# EAGLE schematic M1705Beco (EAGLE 6.6.0)

## Sheet 1 of 3
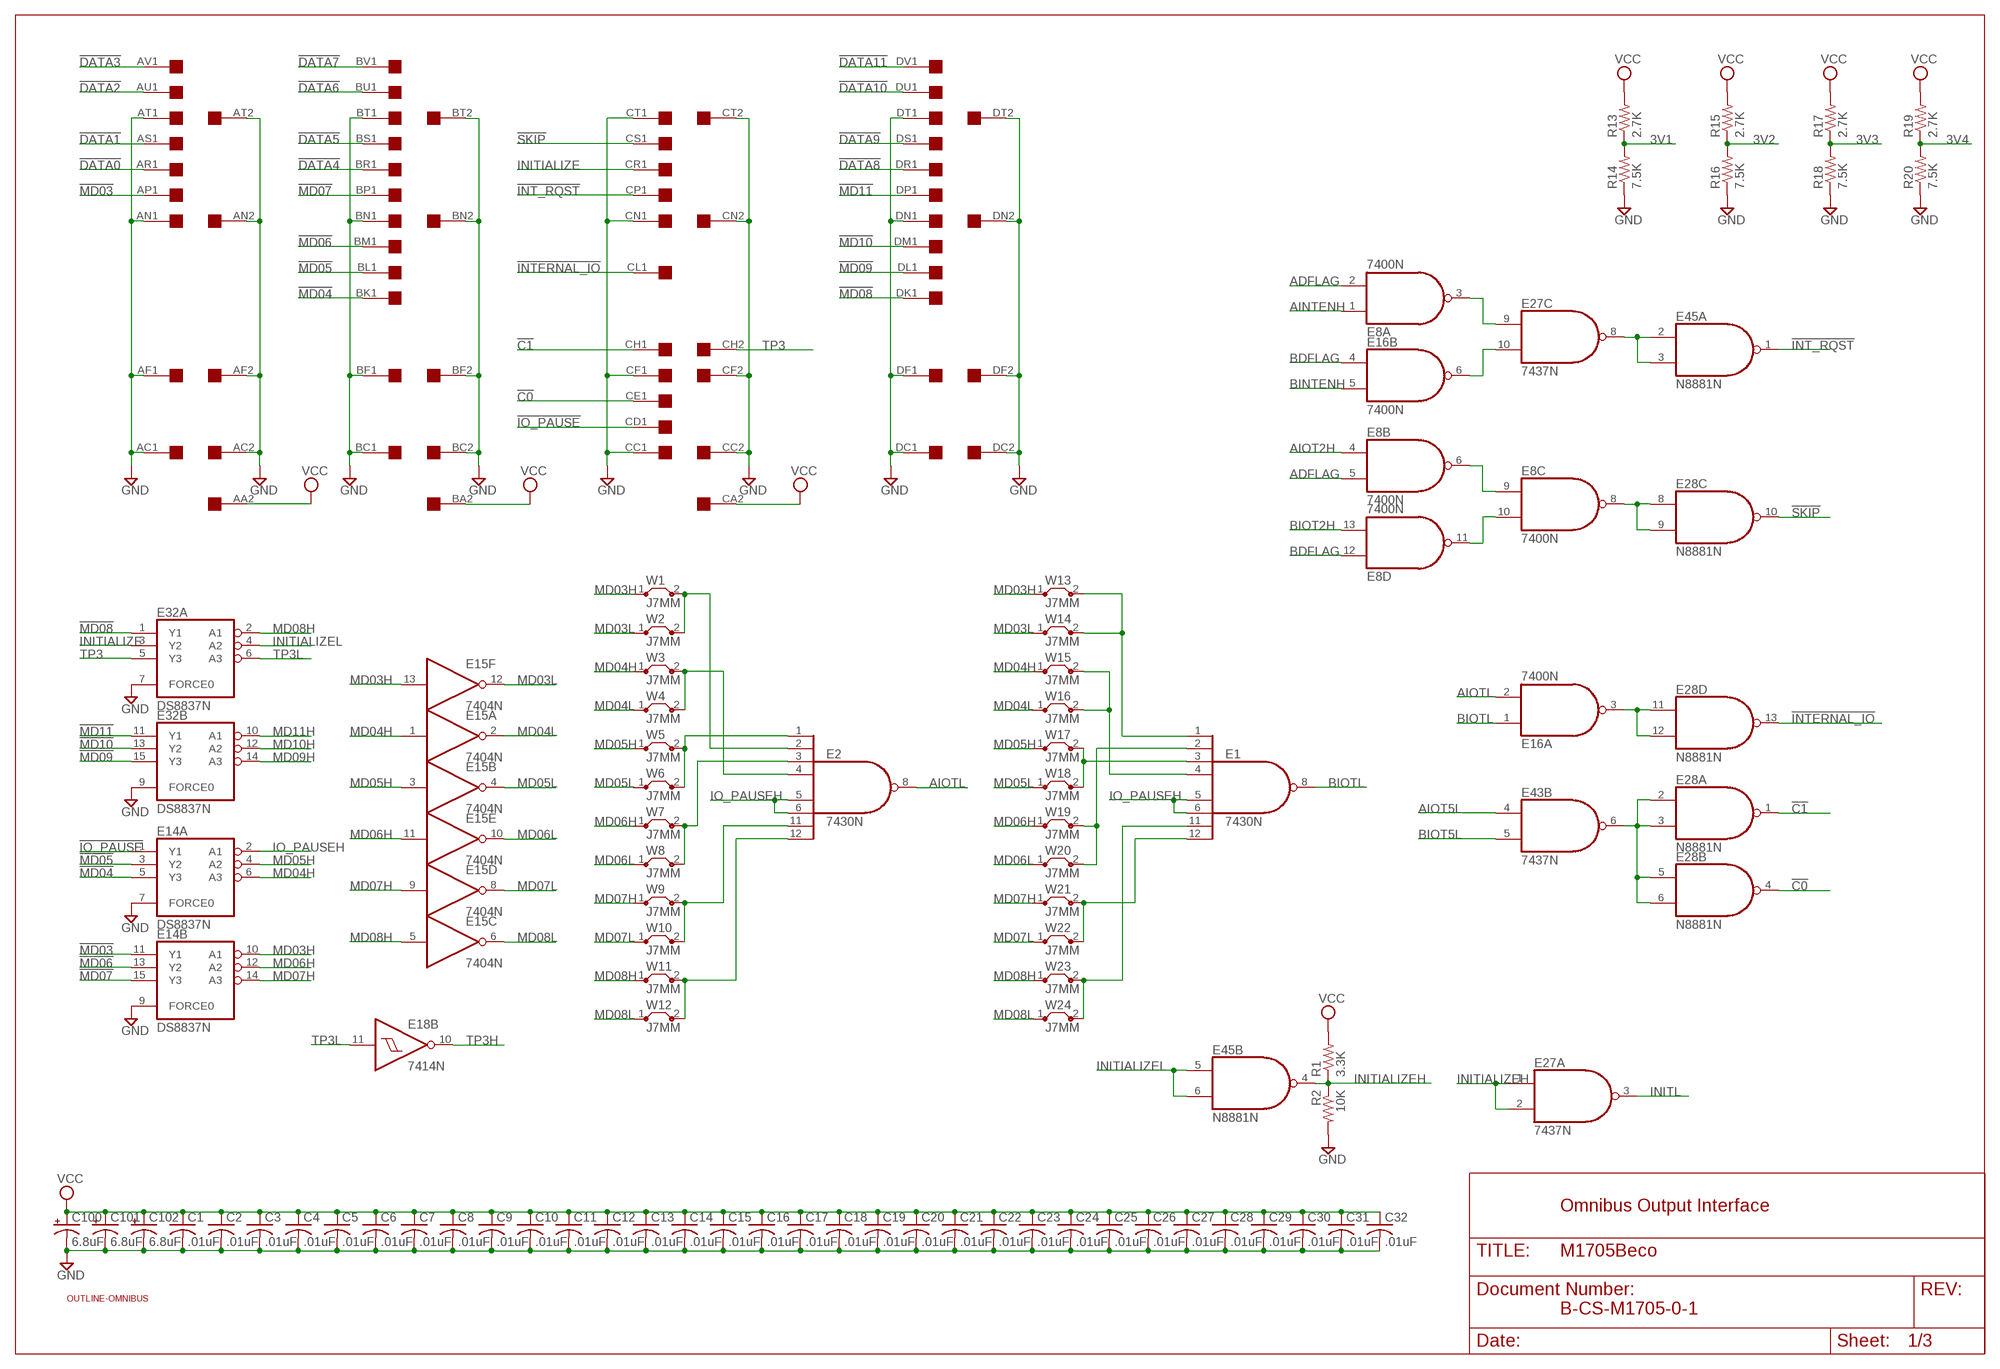
[diagram p0: schematic, sheet 1]

### Parts
C1  .01uF  C-US075-032X103  [C075-032X103]
C2  .01uF  C-US075-032X103  [C075-032X103]
C3  .01uF  C-US075-032X103  [C075-032X103]
C4  .01uF  C-US075-032X103  [C075-032X103]
C5  .01uF  C-US075-032X103  [C075-032X103]
C6  .01uF  C-US075-032X103  [C075-032X103]
C7  .01uF  C-US075-032X103  [C075-032X103]
C8  .01uF  C-US075-032X103  [C075-032X103]
C9  .01uF  C-US075-032X103  [C075-032X103]
C10  .01uF  C-US075-032X103  [C075-032X103]
C11  .01uF  C-US075-032X103  [C075-032X103]
C12  .01uF  C-US075-032X103  [C075-032X103]
C13  .01uF  C-US075-032X103  [C075-032X103]
C14  .01uF  C-US075-032X103  [C075-032X103]
C15  .01uF  C-US075-032X103  [C075-032X103]
C16  .01uF  C-US075-032X103  [C075-032X103]
C17  .01uF  C-US075-032X103  [C075-032X103]
C18  .01uF  C-US075-032X103  [C075-032X103]
C19  .01uF  C-US075-032X103  [C075-032X103]
C20  .01uF  C-US075-032X103  [C075-032X103]
C21  .01uF  C-US075-032X103  [C075-032X103]
C22  .01uF  C-US075-032X103  [C075-032X103]
C23  .01uF  C-US075-032X103  [C075-032X103]
C24  .01uF  C-US075-032X103  [C075-032X103]
C25  .01uF  C-US075-032X103  [C075-032X103]
C26  .01uF  C-US075-032X103  [C075-032X103]
C27  .01uF  C-US075-032X103  [C075-032X103]
C28  .01uF  C-US075-032X103  [C075-032X103]
C29  .01uF  C-US075-032X103  [C075-032X103]
C30  .01uF  C-US075-032X103  [C075-032X103]
C31  .01uF  C-US075-032X103  [C075-032X103]
C32  .01uF  C-US075-032X103  [C075-032X103]
C100  6.8uF  CPOL-USE20-8AXIAL  [E12-8]
C101  6.8uF  CPOL-USE20-8AXIAL  [E12-8]
C102  6.8uF  CPOL-USE20-8AXIAL  [E12-8]
E1  7430N  [DIL14]
E2  7430N  [DIL14]
E8  7400N  [DIL14]
E14  DS8837N  [DIL16]
E15  7404N  [DIL14]
E16  7400N  [DIL14]
E18  7414N  [DIL14]
E27  7437N  [DIL14]
E28  N8881N  [DIL14]
E32  DS8837N  [DIL16]
E43  7437N  [DIL14]
E45  N8881N  [DIL14]
R1  3.3K  R-US_0207/10  [0207/10]
R2  10K  R-US_0207/10  [0207/10]
R13  2.7K  R-US_0207/10  [0207/10]
R14  7.5K  R-US_0207/10  [0207/10]
R15  2.7K  R-US_0207/10  [0207/10]
R16  7.5K  R-US_0207/10  [0207/10]
R17  2.7K  R-US_0207/10  [0207/10]
R18  7.5K  R-US_0207/10  [0207/10]
R19  2.7K  R-US_0207/10  [0207/10]
R20  7.5K  R-US_0207/10  [0207/10]
U$2  QUAD  [EDGE-CON8]
U$4  OUTLINE-OMNIBUS  [OMNIBUS]
W1  J7MM  [07]
W2  J7MM  [07]
W3  J7MM  [07]
W4  J7MM  [07]
W5  J7MM  [07]
W6  J7MM  [07]
W7  J7MM  [07]
W8  J7MM  [07]
W9  J7MM  [07]
W10  J7MM  [07]
W11  J7MM  [07]
W12  J7MM  [07]
W13  J7MM  [07]
W14  J7MM  [07]
W15  J7MM  [07]
W16  J7MM  [07]
W17  J7MM  [07]
W18  J7MM  [07]
W19  J7MM  [07]
W20  J7MM  [07]
W21  J7MM  [07]
W22  J7MM  [07]
W23  J7MM  [07]
W24  J7MM  [07]

### Nets
3V1: R13.1 R14.2 ; also sheet 2,3
3V2: R15.1 R16.2 ; also sheet 2,3
3V3: R17.1 R18.2 ; also sheet 2,3
3V4: R19.1 R20.2 ; also sheet 2,3
!C0: E28.4(B:O) U$2.CE1
!C1: E28.1(A:O) U$2.CH1
!DATA0: U$2.AR1 ; also sheet 2,3
!DATA1: U$2.AS1 ; also sheet 2,3
!DATA2: U$2.AU1 ; also sheet 2,3
!DATA3: U$2.AV1 ; also sheet 2,3
!DATA4: U$2.BR1 ; also sheet 2,3
!DATA5: U$2.BS1 ; also sheet 2,3
!DATA6: U$2.BU1 ; also sheet 2,3
!DATA7: U$2.BV1 ; also sheet 2,3
!DATA8: U$2.DR1 ; also sheet 2,3
!DATA9: U$2.DS1 ; also sheet 2,3
!DATA10: U$2.DU1 ; also sheet 2,3
!DATA11: U$2.DV1 ; also sheet 2,3
!INT_RQST: E45.1(A:O) U$2.CP1
!INTERNAL_IO: E28.13(D:O) U$2.CL1
!IO_PAUSE: E14.1(A:Y1) U$2.CD1
!MD03: E14.11(B:Y1) U$2.AP1
!MD04: E14.5(A:Y3) U$2.BK1
!MD05: E14.3(A:Y2) U$2.BL1
!MD06: E14.13(B:Y2) U$2.BM1
!MD07: E14.15(B:Y3) U$2.BP1
!MD08: E32.1(A:Y1) U$2.DK1
!MD09: E32.15(B:Y3) U$2.DL1
!MD10: E32.13(B:Y2) U$2.DM1
!MD11: E32.11(B:Y1) U$2.DP1
!SKIP: E28.10(C:O) U$2.CS1
ADFLAG: E8.2(A:I1) E8.5(B:I1) ; also sheet 2
AINTENH: E8.1(A:I0) ; also sheet 2
AIOT2H: E8.4(B:I0) ; also sheet 2
AIOT5L: E43.4(B:I0) ; also sheet 2
AIOTL: E2.8(O) E16.2(A:I1) ; also sheet 2
BDFLAG: E8.12(D:I0) E16.4(B:I0) ; also sheet 3
BINTENH: E16.5(B:I1) ; also sheet 3
BIOT2H: E8.13(D:I1) ; also sheet 3
BIOT5L: E43.5(B:I1) ; also sheet 3
BIOTL: E1.8(O) E16.1(A:I0) ; also sheet 3
GND [Supply]: C1.2 C2.2 C3.2 C4.2 C5.2 C6.2 C7.2 C8.2 C9.2 C10.2 C11.2 C12.2 C13.2 C14.2 C15.2 C16.2 C17.2 C18.2 C19.2 C20.2 C21.2 C22.2 C23.2 C24.2 C25.2 C26.2 C27.2 C28.2 C29.2 C30.2 C31.2 C32.2 C100.- C101.- C102.- E14.7(A:FORCE0) E14.9(B:FORCE0) E32.7(A:FORCE0) E32.9(B:FORCE0) R2.2 R14.1 R16.1 R18.1 R20.1 U$2.AC1 U$2.AC2 U$2.AF1 U$2.AF2 U$2.AN1 U$2.AN2 U$2.AT1 U$2.AT2 U$2.BC1 U$2.BC2 U$2.BF1 U$2.BF2 U$2.BN1 U$2.BN2 U$2.BT1 U$2.BT2 U$2.CC1 U$2.CC2 U$2.CF1 U$2.CF2 U$2.CN1 U$2.CN2 U$2.CT1 U$2.CT2 U$2.DC1 U$2.DC2 U$2.DF1 U$2.DF2 U$2.DN1 U$2.DN2 U$2.DT1 U$2.DT2 ; also sheet 2,3
INITIALIZE: E32.3(A:Y2) U$2.CR1
INITIALIZEH: E27.1(A:I0) E27.2(A:I1) E45.4(B:O) R1.1 R2.1
INITIALIZEL: E32.4(A:A2) E45.5(B:I0) E45.6(B:I1) ; also sheet 2,3
INITL: E27.3(A:O) ; also sheet 2,3
IO_PAUSEH: E1.5(I4) E1.6(I5) E2.5(I4) E2.6(I5) E14.2(A:A1)
MD03H: E14.10(B:A1) E15.13(F:I) W1.1 W13.1
MD03L: E15.12(F:O) W2.1 W14.1
MD04H: E14.6(A:A3) E15.1(A:I) W3.1 W15.1
MD04L: E15.2(A:O) W4.1 W16.1
MD05H: E14.4(A:A2) E15.3(B:I) W5.1 W17.1
MD05L: E15.4(B:O) W6.1 W18.1
MD06H: E14.12(B:A2) E15.11(E:I) W7.1 W19.1
MD06L: E15.10(E:O) W8.1 W20.1
MD07H: E14.14(B:A3) E15.9(D:I) W9.1 W21.1
MD07L: E15.8(D:O) W10.1 W22.1
MD08H: E15.5(C:I) E32.2(A:A1) W11.1 W23.1
MD08L: E15.6(C:O) W12.1 W24.1
MD09H: E32.14(B:A3) ; also sheet 2,3
MD10H: E32.12(B:A2) ; also sheet 2,3
MD11H: E32.10(B:A1) ; also sheet 2,3
N$24: E1.3(I2) W17.2 W18.2
N$29: E1.1(I0) W13.2 W14.2
N$31: E2.11(I6) W9.2 W10.2
N$32: E1.12(I7) W21.2 W22.2
N$33: E1.11(I6) W23.2 W24.2
N$36: E1.4(I3) W15.2 W16.2
N$38: E1.2(I1) W19.2 W20.2
N$39: E2.1(I0) W5.2 W6.2
N$40: E2.2(I1) W1.2 W2.2
N$41: E2.3(I2) W7.2 W8.2
N$42: E2.4(I3) W3.2 W4.2
N$45: E2.12(I7) W11.2 W12.2
N$53: E8.8(C:O) E28.8(C:I0) E28.9(C:I1)
N$118: E8.3(A:O) E27.9(C:I0)
N$119: E8.10(C:I1) E8.11(D:O)
N$120: E8.6(B:O) E8.9(C:I0)
N$196: E16.3(A:O) E28.11(D:I0) E28.12(D:I1)
N$199: E16.6(B:O) E27.10(C:I1)
N$337: E28.2(A:I0) E28.3(A:I1) E28.5(B:I0) E28.6(B:I1) E43.6(B:O)
N$350: E27.8(C:O) E45.2(A:I0) E45.3(A:I1)
TP3: E32.5(A:Y3) U$2.CH2
TP3H: E18.10(B:O) ; also sheet 2,3
TP3L: E18.11(B:I) E32.6(A:A3)
VCC [Supply]: C1.1 C2.1 C3.1 C4.1 C5.1 C6.1 C7.1 C8.1 C9.1 C10.1 C11.1 C12.1 C13.1 C14.1 C15.1 C16.1 C17.1 C18.1 C19.1 C20.1 C21.1 C22.1 C23.1 C24.1 C25.1 C26.1 C27.1 C28.1 C29.1 C30.1 C31.1 C32.1 C100.+ C101.+ C102.+ R1.2 R13.2 R15.2 R17.2 R19.2 U$2.AA2 U$2.BA2 U$2.CA2 ; also sheet 2,3
Unconnected: E18.12(A:O) E18.13(A:I) E45.8(C:I0) E45.9(C:I1) E45.10(C:O) E45.11(D:I0) E45.12(D:I1) E45.13(D:O) U$2.AA1 U$2.AB1 U$2.AB2 U$2.AD1 U$2.AD2 U$2.AE1 U$2.AE2 U$2.AH1 U$2.AH2 U$2.AJ1 U$2.AJ2 U$2.AK1 U$2.AK2 U$2.AL1 U$2.AL2 U$2.AM1 U$2.AM2 U$2.AP2 U$2.AR2 U$2.AS2 U$2.AU2 U$2.AV2 U$2.BA1 U$2.BB1 U$2.BB2 U$2.BD1 U$2.BD2 U$2.BE1 U$2.BE2 U$2.BH1 U$2.BH2 U$2.BJ1 U$2.BJ2 U$2.BK2 U$2.BL2 U$2.BM2 U$2.BP2 U$2.BR2 U$2.BS2 U$2.BU2 U$2.BV2 U$2.CA1 U$2.CB1 U$2.CB2 U$2.CD2 U$2.CE2 U$2.CJ1 U$2.CJ2 U$2.CK1 U$2.CK2 U$2.CL2 U$2.CM1 U$2.CM2 U$2.CP2 U$2.CR2 U$2.CS2 U$2.CU1 U$2.CU2 U$2.CV1 U$2.CV2 U$2.DA1 U$2.DA2 U$2.DB1 U$2.DB2 U$2.DD1 U$2.DD2 U$2.DE1 U$2.DE2 U$2.DH1 U$2.DH2 U$2.DJ1 U$2.DJ2 U$2.DK2 U$2.DL2 U$2.DM2 U$2.DP2 U$2.DR2 U$2.DS2 U$2.DU2 U$2.DV2

### Notes on the sheet
- Omnibus Output Interface
- B-CS-M1705-0-1

## Sheet 2 of 3
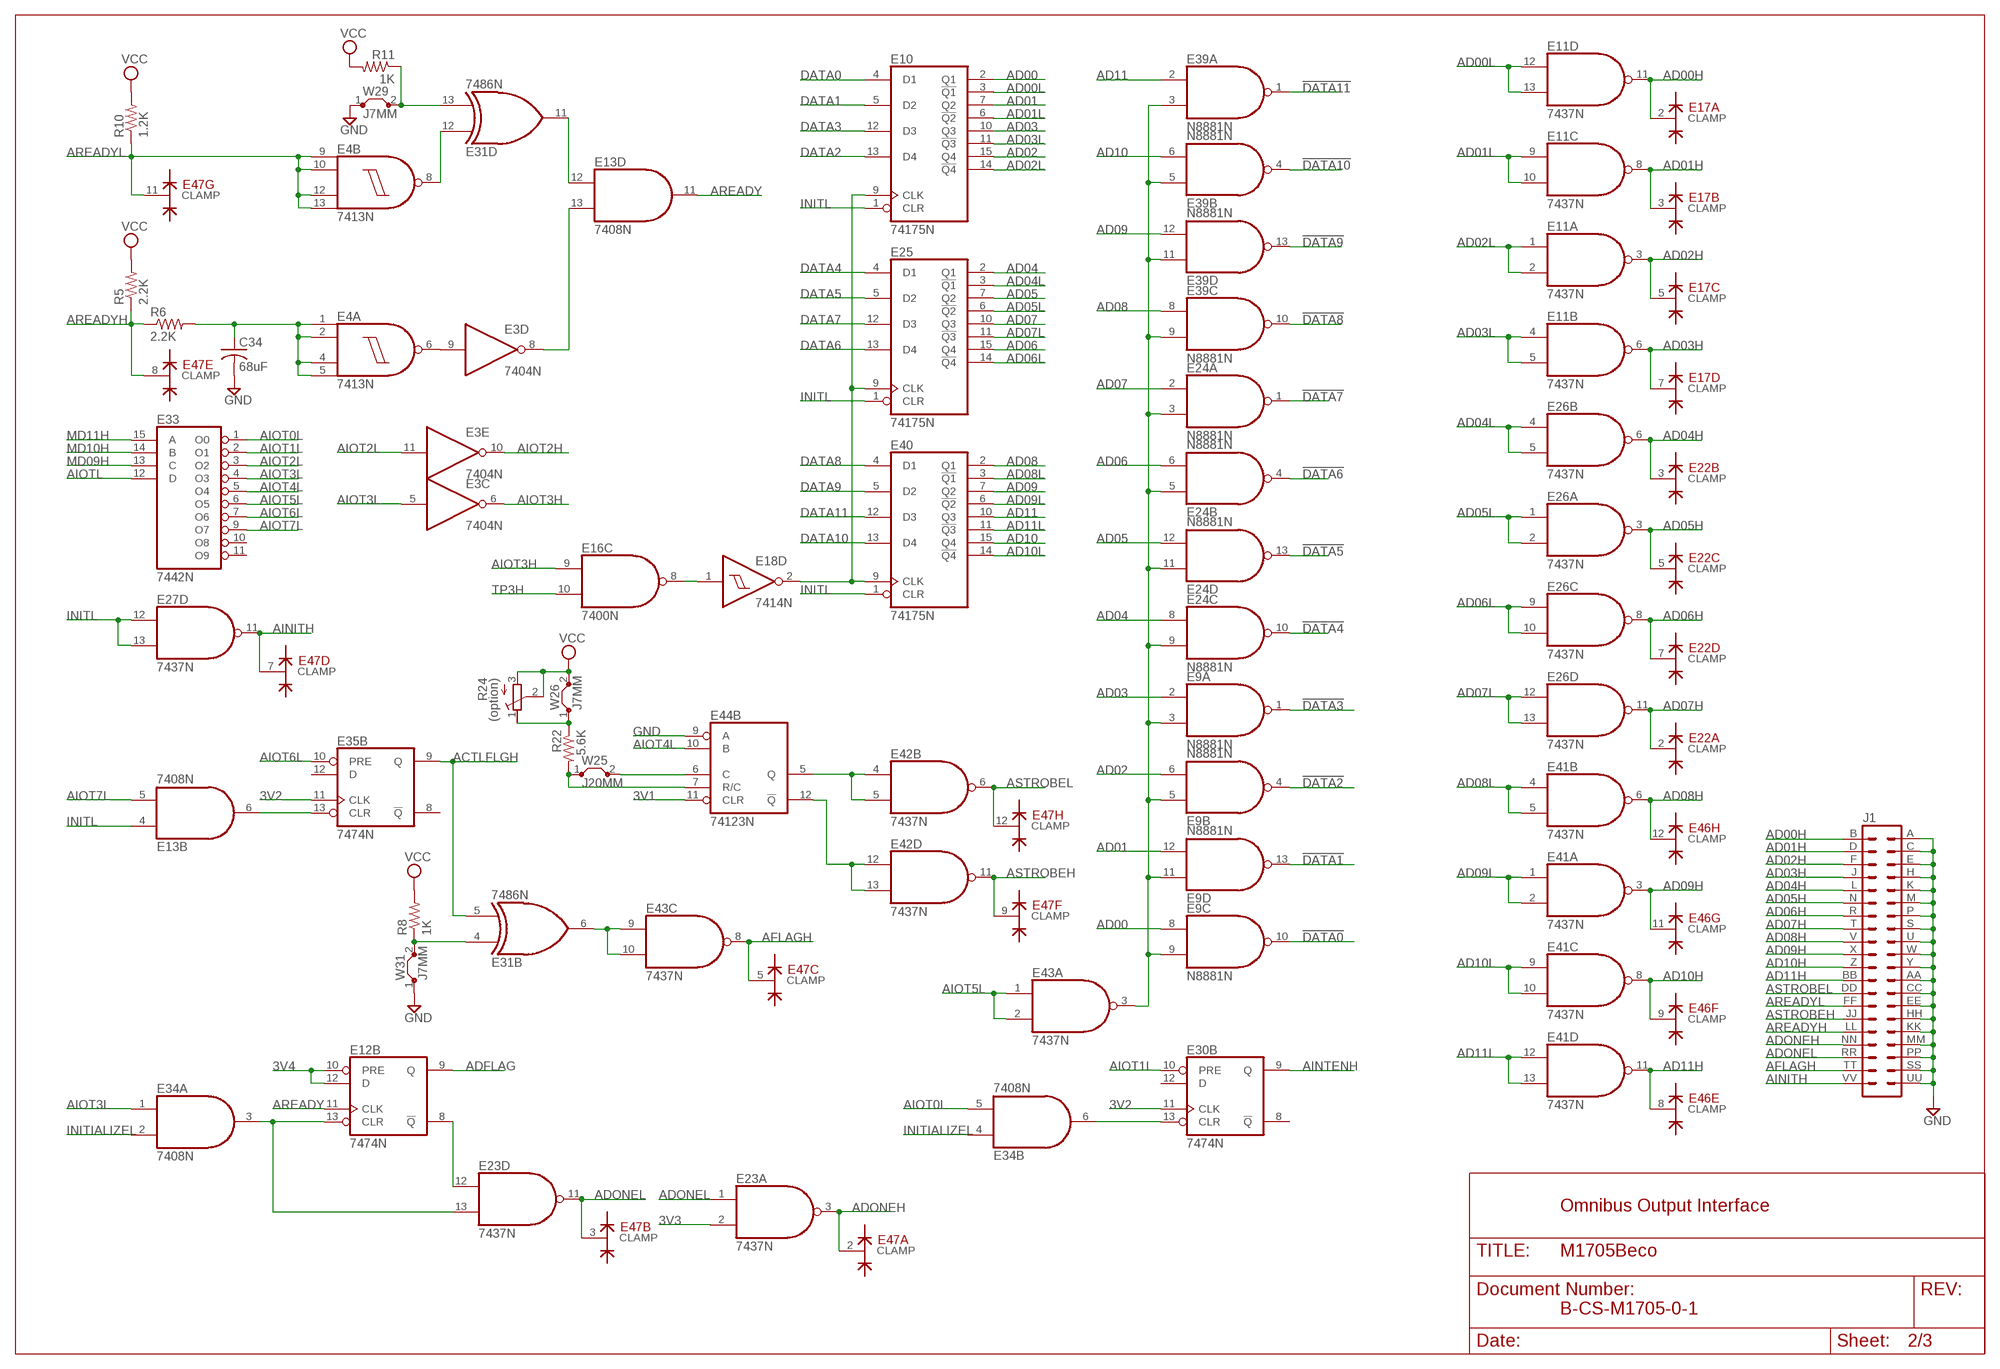
[diagram p1: schematic, sheet 2]

### Parts
C34  68uF  C-US102-043X133  [C102-043X133]
E3  7404N  [DIL14]
E4  7413N  [DIL14]
E9  N8881N  [DIL14]
E10  74175N  [DIL16]
E11  7437N  [DIL14]
E12  7474N  74S74N  [DIL14]
E13  7408N  74LS08N  [DIL14]
E17  DEC2501  [DIL14]
E22  DEC2501  [DIL14]
E23  7437N  [DIL14]
E24  N8881N  [DIL14]
E25  74175N  [DIL16]
E26  7437N  [DIL14]
E30  7474N  74S74N  [DIL14]
E31  7486N  [DIL14]
E33  7442N  74LS42N  [DIL16]
E34  7408N  74LS08N  [DIL14]
E35  7474N  74S74N  [DIL14]
E39  N8881N  [DIL14]
E40  74175N  [DIL16]
E41  7437N  [DIL14]
E42  7437N  [DIL14]
E44  74123N  [DIL16]
E46  DEC2501  [DIL14]
E47  DEC2501  [DIL14]
J1  DEC40PINH  [DEC40PINH]
R5  2.2K  R-US_0207/10  [0207/10]
R6  2.2K  R-US_0207/10  [0207/10]
R8  1K  R-US_0207/10  [0207/10]
R10  1.2K  R-US_0207/10  [0207/10]
R11  1K  R-US_0207/10  [0207/10]
R22  5.6K  R-US_0207/10  [0207/10]
R24  (option)  275P  [3006Y]
W25  J20MM  [20]
W26  J7MM  [07]
W29  J7MM  [07]
W31  J7MM  [07]

### Nets
3V1: E44.11(B:CLR) ; also sheet 1,3
3V2: E30.11(B:CLK) E35.11(B:CLK) ; also sheet 1,3
3V3: E23.2(A:I1) ; also sheet 1,3
3V4: E12.10(B:PRE) E12.12(B:D) ; also sheet 1,3
!DATA0: E9.10(C:O) ; also sheet 1,3
!DATA1: E9.13(D:O) ; also sheet 1,3
!DATA2: E9.4(B:O) ; also sheet 1,3
!DATA3: E9.1(A:O) ; also sheet 1,3
!DATA4: E24.10(C:O) ; also sheet 1,3
!DATA5: E24.13(D:O) ; also sheet 1,3
!DATA6: E24.4(B:O) ; also sheet 1,3
!DATA7: E24.1(A:O) ; also sheet 1,3
!DATA8: E39.10(C:O) ; also sheet 1,3
!DATA9: E39.13(D:O) ; also sheet 1,3
!DATA10: E39.4(B:O) ; also sheet 1,3
!DATA11: E39.1(A:O) ; also sheet 1,3
ACTLFLGH: E31.5(B:I1) E35.9(B:Q)
AD00: E9.8(C:I0) E10.2(Q1)
AD00H: E11.11(D:O) E17.2(A:CLAMP) J1.B
AD00L: E10.3(!Q1) E11.12(D:I0) E11.13(D:I1)
AD01: E9.12(D:I1) E10.7(Q2)
AD01H: E11.8(C:O) E17.3(B:CLAMP) J1.D
AD01L: E10.6(!Q2) E11.9(C:I0) E11.10(C:I1)
AD02: E9.6(B:I1) E10.15(Q4)
AD02H: E11.3(A:O) E17.5(C:CLAMP) J1.F
AD02L: E10.14(!Q4) E11.1(A:I0) E11.2(A:I1)
AD03: E9.2(A:I0) E10.10(Q3)
AD03H: E11.6(B:O) E17.7(D:CLAMP) J1.J
AD03L: E10.11(!Q3) E11.4(B:I0) E11.5(B:I1)
AD04: E24.8(C:I0) E25.2(Q1)
AD04H: E22.3(B:CLAMP) E26.6(B:O) J1.L
AD04L: E25.3(!Q1) E26.4(B:I0) E26.5(B:I1)
AD05: E24.12(D:I1) E25.7(Q2)
AD05H: E22.5(C:CLAMP) E26.3(A:O) J1.N
AD05L: E25.6(!Q2) E26.1(A:I0) E26.2(A:I1)
AD06: E24.6(B:I1) E25.15(Q4)
AD06H: E22.7(D:CLAMP) E26.8(C:O) J1.R
AD06L: E25.14(!Q4) E26.9(C:I0) E26.10(C:I1)
AD07: E24.2(A:I0) E25.10(Q3)
AD07H: E22.2(A:CLAMP) E26.11(D:O) J1.T
AD07L: E25.11(!Q3) E26.12(D:I0) E26.13(D:I1)
AD08: E39.8(C:I0) E40.2(Q1)
AD08H: E41.6(B:O) E46.12(H:CLAMP) J1.V
AD08L: E40.3(!Q1) E41.4(B:I0) E41.5(B:I1)
AD09: E39.12(D:I1) E40.7(Q2)
AD09H: E41.3(A:O) E46.11(G:CLAMP) J1.X
AD09L: E40.6(!Q2) E41.1(A:I0) E41.2(A:I1)
AD10: E39.6(B:I1) E40.15(Q4)
AD10H: E41.8(C:O) E46.9(F:CLAMP) J1.Z
AD10L: E40.14(!Q4) E41.9(C:I0) E41.10(C:I1)
AD11: E39.2(A:I0) E40.10(Q3)
AD11H: E41.11(D:O) E46.8(E:CLAMP) J1.BB
AD11L: E40.11(!Q3) E41.12(D:I0) E41.13(D:I1)
ADFLAG: E12.9(B:Q) ; also sheet 1
ADONEH: E23.3(A:O) E47.2(A:CLAMP) J1.NN
ADONEL: E23.1(A:I0) E23.11(D:O) E47.3(B:CLAMP) J1.RR
AFLAGH: E43.8(C:O) E47.5(C:CLAMP) J1.TT
AINITH: E27.11(D:O) E47.7(D:CLAMP) J1.VV
AINTENH: E30.9(B:Q) ; also sheet 1
AIOT0L: E33.1(O0) E34.5(B:I1)
AIOT1L: E30.10(B:PRE) E33.2(O1)
AIOT2H: E3.10(E:O) ; also sheet 1
AIOT2L: E3.11(E:I) E33.3(O2)
AIOT3H: E3.6(C:O) E16.9(C:I0)
AIOT3L: E3.5(C:I) E33.4(O3) E34.1(A:I0)
AIOT4L: E33.5(O4) E44.10(B:B)
AIOT5L: E33.6(O5) E43.1(A:I0) E43.2(A:I1) ; also sheet 1
AIOT6L: E33.7(O6) E35.10(B:PRE)
AIOT7L: E13.5(B:I1) E33.9(O7)
AIOTL: E33.12(D) ; also sheet 1
AREADY: E12.11(B:CLK) E13.11(D:O)
AREADYH: E47.8(E:CLAMP) J1.LL R5.1 R6.1
AREADYL: E4.9(B:I0) E4.10(B:I1) E4.12(B:I2) E4.13(B:I3) E47.11(G:CLAMP) J1.FF R10.1
ASTROBEH: E42.11(D:O) E47.9(F:CLAMP) J1.JJ
ASTROBEL: E42.6(B:O) E47.12(H:CLAMP) J1.DD
DATA0: E10.4(D1) ; also sheet 3
DATA1: E10.5(D2) ; also sheet 3
DATA2: E10.13(D4) ; also sheet 3
DATA3: E10.12(D3) ; also sheet 3
DATA4: E25.4(D1) ; also sheet 3
DATA5: E25.5(D2) ; also sheet 3
DATA6: E25.13(D4) ; also sheet 3
DATA7: E25.12(D3) ; also sheet 3
DATA8: E40.4(D1) ; also sheet 3
DATA9: E40.5(D2) ; also sheet 3
DATA10: E40.13(D4) ; also sheet 3
DATA11: E40.12(D3) ; also sheet 3
GND [Supply]: C34.2 E44.9(B:A) J1.A J1.AA J1.C J1.CC J1.E J1.EE J1.H J1.HH J1.K J1.KK J1.M J1.MM J1.P J1.PP J1.S J1.SS J1.U J1.UU J1.W J1.Y W29.1 W31.1 ; also sheet 1,3
INITIALIZEL: E34.2(A:I1) E34.4(B:I0) ; also sheet 1,3
INITL: E10.1(CLR) E13.4(B:I0) E25.1(CLR) E27.12(D:I0) E27.13(D:I1) E40.1(CLR) ; also sheet 1,3
MD09H: E33.13(C) ; also sheet 1,3
MD10H: E33.14(B) ; also sheet 1,3
MD11H: E33.15(A) ; also sheet 1,3
N$1: E9.3(A:I1) E9.5(B:I0) E9.9(C:I1) E9.11(D:I0) E24.3(A:I1) E24.5(B:I0) E24.9(C:I1) E24.11(D:I0) E39.3(A:I1) E39.5(B:I0) E39.9(C:I1) E39.11(D:I0) E43.3(A:O)
N$6: E16.8(C:O) E18.1(D:I)
N$20: E10.9(CLK) E18.2(D:O) E25.9(CLK) E40.9(CLK)
N$60: E3.9(D:I) E4.6(A:O)
N$64: E3.8(D:O) E13.13(D:I1)
N$69: C34.1 E4.1(A:I0) E4.2(A:I1) E4.4(A:I2) E4.5(A:I3) R6.2
N$76: E4.8(B:O) E31.12(D:I0)
N$103: E31.13(D:I1) R11.1 W29.2
N$146: E12.13(B:CLR) E23.13(D:I1) E34.3(A:O)
N$147: E12.8(B:!Q) E23.12(D:I0)
N$172: E31.4(B:I0) R8.1 W31.2
N$194: E13.6(B:O) E35.13(B:CLR)
N$217: E13.12(D:I0) E31.11(D:O)
N$332: E30.13(B:CLR) E34.6(B:O)
N$386: E31.6(B:O) E43.9(C:I0) E43.10(C:I1)
N$488: E44.6(B:C) W25.2
N$491: E44.7(B:R/C) R22.2 W25.1
N$496: R22.1 R24.1(A) W26.1
N$526: E42.12(D:I0) E42.13(D:I1) E44.12(B:!Q)
N$530: E42.4(B:I0) E42.5(B:I1) E44.5(B:Q)
TP3H: E16.10(C:I1) ; also sheet 1,3
VCC [Supply]: R5.2 R8.2 R10.2 R11.2 R24.2(S) R24.3(E) W26.2 ; also sheet 1,3
Unconnected: E30.8(B:!Q) E30.12(B:D) E33.10(O8) E33.11(O9) E35.8(B:!Q) E35.12(B:D)

### Notes on the sheet
- Omnibus Output Interface
- B-CS-M1705-0-1

## Sheet 3 of 3
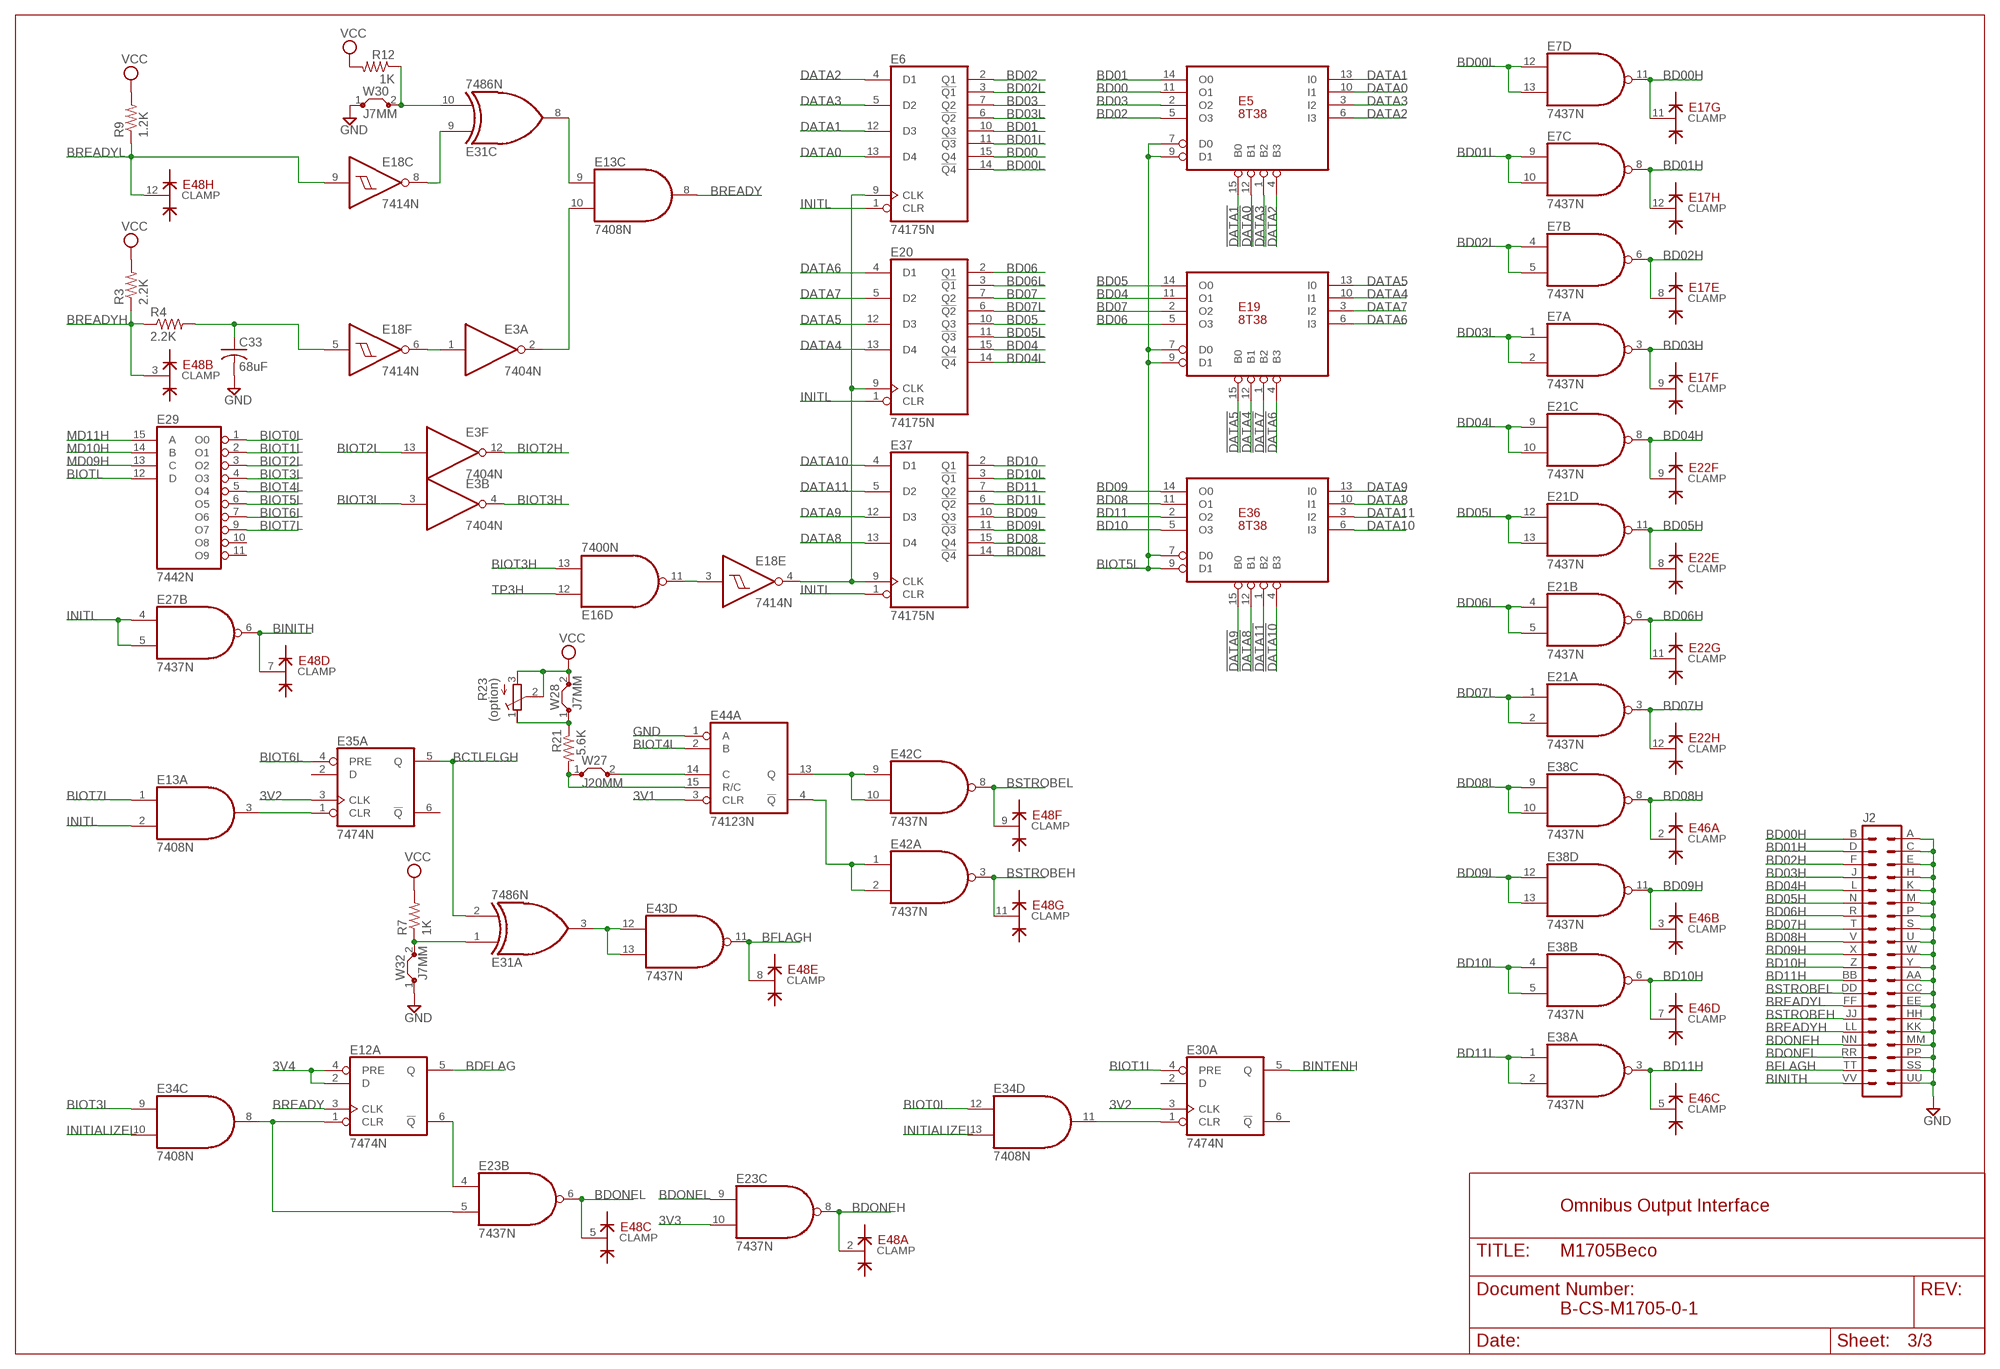
[diagram p2: schematic, sheet 3]

### Parts
C33  68uF  C-US102-043X133  [C102-043X133]
E5  8T38  DS8641N  [DIL16]
E6  74175N  [DIL16]
E7  7437N  [DIL14]
E19  8T38  DS8641N  [DIL16]
E20  74175N  [DIL16]
E21  7437N  [DIL14]
E29  7442N  74LS42N  [DIL16]
E36  8T38  DS8641N  [DIL16]
E37  74175N  [DIL16]
E38  7437N  [DIL14]
E48  DEC2501  [DIL14]
J2  DEC40PINH  [DEC40PINH]
R3  2.2K  R-US_0207/10  [0207/10]
R4  2.2K  R-US_0207/10  [0207/10]
R7  1K  R-US_0207/10  [0207/10]
R9  1.2K  R-US_0207/10  [0207/10]
R12  1K  R-US_0207/10  [0207/10]
R21  5.6K  R-US_0207/10  [0207/10]
R23  (option)  275P  [3006Y]
W27  J20MM  [20]
W28  J7MM  [07]
W30  J7MM  [07]
W32  J7MM  [07]

### Nets
3V1: E44.3(A:CLR) ; also sheet 1,2
3V2: E30.3(A:CLK) E35.3(A:CLK) ; also sheet 1,2
3V3: E23.10(C:I1) ; also sheet 1,2
3V4: E12.2(A:D) E12.4(A:PRE) ; also sheet 1,2
!DATA0: E5.12(B1) ; also sheet 1,2
!DATA1: E5.15(B0) ; also sheet 1,2
!DATA2: E5.4(B3) ; also sheet 1,2
!DATA3: E5.1(B2) ; also sheet 1,2
!DATA4: E19.12(B1) ; also sheet 1,2
!DATA5: E19.15(B0) ; also sheet 1,2
!DATA6: E19.4(B3) ; also sheet 1,2
!DATA7: E19.1(B2) ; also sheet 1,2
!DATA8: E36.12(B1) ; also sheet 1,2
!DATA9: E36.15(B0) ; also sheet 1,2
!DATA10: E36.4(B3) ; also sheet 1,2
!DATA11: E36.1(B2) ; also sheet 1,2
BCTLFLGH: E31.2(A:I1) E35.5(A:Q)
BD00: E5.11(O1) E6.15(Q4)
BD00H: E7.11(D:O) E17.11(G:CLAMP) J2.B
BD00L: E6.14(!Q4) E7.12(D:I0) E7.13(D:I1)
BD01: E5.14(O0) E6.10(Q3)
BD01H: E7.8(C:O) E17.12(H:CLAMP) J2.D
BD01L: E6.11(!Q3) E7.9(C:I0) E7.10(C:I1)
BD02: E5.5(O3) E6.2(Q1)
BD02H: E7.6(B:O) E17.8(E:CLAMP) J2.F
BD02L: E6.3(!Q1) E7.4(B:I0) E7.5(B:I1)
BD03: E5.2(O2) E6.7(Q2)
BD03H: E7.3(A:O) E17.9(F:CLAMP) J2.J
BD03L: E6.6(!Q2) E7.1(A:I0) E7.2(A:I1)
BD04: E19.11(O1) E20.15(Q4)
BD04H: E21.8(C:O) E22.9(F:CLAMP) J2.L
BD04L: E20.14(!Q4) E21.9(C:I0) E21.10(C:I1)
BD05: E19.14(O0) E20.10(Q3)
BD05H: E21.11(D:O) E22.8(E:CLAMP) J2.N
BD05L: E20.11(!Q3) E21.12(D:I0) E21.13(D:I1)
BD06: E19.5(O3) E20.2(Q1)
BD06H: E21.6(B:O) E22.11(G:CLAMP) J2.R
BD06L: E20.3(!Q1) E21.4(B:I0) E21.5(B:I1)
BD07: E19.2(O2) E20.7(Q2)
BD07H: E21.3(A:O) E22.12(H:CLAMP) J2.T
BD07L: E20.6(!Q2) E21.1(A:I0) E21.2(A:I1)
BD08: E36.11(O1) E37.15(Q4)
BD08H: E38.8(C:O) E46.2(A:CLAMP) J2.V
BD08L: E37.14(!Q4) E38.9(C:I0) E38.10(C:I1)
BD09: E36.14(O0) E37.10(Q3)
BD09H: E38.11(D:O) E46.3(B:CLAMP) J2.X
BD09L: E37.11(!Q3) E38.12(D:I0) E38.13(D:I1)
BD10: E36.5(O3) E37.2(Q1)
BD10H: E38.6(B:O) E46.7(D:CLAMP) J2.Z
BD10L: E37.3(!Q1) E38.4(B:I0) E38.5(B:I1)
BD11: E36.2(O2) E37.7(Q2)
BD11H: E38.3(A:O) E46.5(C:CLAMP) J2.BB
BD11L: E37.6(!Q2) E38.1(A:I0) E38.2(A:I1)
BDFLAG: E12.5(A:Q) ; also sheet 1
BDONEH: E23.8(C:O) E48.2(A:CLAMP) J2.NN
BDONEL: E23.6(B:O) E23.9(C:I0) E48.5(C:CLAMP) J2.RR
BFLAGH: E43.11(D:O) E48.8(E:CLAMP) J2.TT
BINITH: E27.6(B:O) E48.7(D:CLAMP) J2.VV
BINTENH: E30.5(A:Q) ; also sheet 1
BIOT0L: E29.1(O0) E34.12(D:I0)
BIOT1L: E29.2(O1) E30.4(A:PRE)
BIOT2H: E3.12(F:O) ; also sheet 1
BIOT2L: E3.13(F:I) E29.3(O2)
BIOT3H: E3.4(B:O) E16.13(D:I1)
BIOT3L: E3.3(B:I) E29.4(O3) E34.9(C:I0)
BIOT4L: E29.5(O4) E44.2(A:B)
BIOT5L: E5.7(D0) E5.9(D1) E19.7(D0) E19.9(D1) E29.6(O5) E36.7(D0) E36.9(D1) ; also sheet 1
BIOT6L: E29.7(O6) E35.4(A:PRE)
BIOT7L: E13.1(A:I0) E29.9(O7)
BIOTL: E29.12(D) ; also sheet 1
BREADY: E12.3(A:CLK) E13.8(C:O)
BREADYH: E48.3(B:CLAMP) J2.LL R3.1 R4.1
BREADYL: E18.9(C:I) E48.12(H:CLAMP) J2.FF R9.1
BSTROBEH: E42.3(A:O) E48.11(G:CLAMP) J2.JJ
BSTROBEL: E42.8(C:O) E48.9(F:CLAMP) J2.DD
DATA0: E5.10(I1) E6.13(D4) ; also sheet 2
DATA1: E5.13(I0) E6.12(D3) ; also sheet 2
DATA2: E5.6(I3) E6.4(D1) ; also sheet 2
DATA3: E5.3(I2) E6.5(D2) ; also sheet 2
DATA4: E19.10(I1) E20.13(D4) ; also sheet 2
DATA5: E19.13(I0) E20.12(D3) ; also sheet 2
DATA6: E19.6(I3) E20.4(D1) ; also sheet 2
DATA7: E19.3(I2) E20.5(D2) ; also sheet 2
DATA8: E36.10(I1) E37.13(D4) ; also sheet 2
DATA9: E36.13(I0) E37.12(D3) ; also sheet 2
DATA10: E36.6(I3) E37.4(D1) ; also sheet 2
DATA11: E36.3(I2) E37.5(D2) ; also sheet 2
GND [Supply]: C33.2 E44.1(A:A) J2.A J2.AA J2.C J2.CC J2.E J2.EE J2.H J2.HH J2.K J2.KK J2.M J2.MM J2.P J2.PP J2.S J2.SS J2.U J2.UU J2.W J2.Y W30.1 W32.1 ; also sheet 1,2
INITIALIZEL: E34.10(C:I1) E34.13(D:I1) ; also sheet 1,2
INITL: E6.1(CLR) E13.2(A:I1) E20.1(CLR) E27.4(B:I0) E27.5(B:I1) E37.1(CLR) ; also sheet 1,2
MD09H: E29.13(C) ; also sheet 1,2
MD10H: E29.14(B) ; also sheet 1,2
MD11H: E29.15(A) ; also sheet 1,2
N$5: E16.11(D:O) E18.3(E:I)
N$56: E3.2(A:O) E13.10(C:I1)
N$57: E3.1(A:I) E18.6(F:O)
N$79: E6.9(CLK) E18.4(E:O) E20.9(CLK) E37.9(CLK)
N$136: E12.1(A:CLR) E23.5(B:I1) E34.8(C:O)
N$151: E12.6(A:!Q) E23.4(B:I0)
N$165: E31.10(C:I1) R12.1 W30.2
N$171: E31.1(A:I0) R7.1 W32.2
N$193: E13.3(A:O) E35.1(A:CLR)
N$219: E13.9(C:I0) E31.8(C:O)
N$273: C33.1 E18.5(F:I) R4.2
N$280: E18.8(C:O) E31.9(C:I0)
N$347: E31.3(A:O) E43.12(D:I0) E43.13(D:I1)
N$362: E30.1(A:CLR) E34.11(D:O)
N$476: E44.14(A:C) W27.2
N$480: R21.1 R23.1(A) W28.1
N$483: E42.1(A:I0) E42.2(A:I1) E44.4(A:!Q)
N$528: E42.9(C:I0) E42.10(C:I1) E44.13(A:Q)
N$586: E44.15(A:R/C) R21.2 W27.1
TP3H: E16.12(D:I0) ; also sheet 1,2
VCC [Supply]: R3.2 R7.2 R9.2 R12.2 R23.2(S) R23.3(E) W28.2 ; also sheet 1,2
Unconnected: E29.10(O8) E29.11(O9) E30.2(A:D) E30.6(A:!Q) E35.2(A:D) E35.6(A:!Q)

### Notes on the sheet
- Omnibus Output Interface
- B-CS-M1705-0-1

## Power pins joined to a net without a drawn wire
GND: E1.7(GND) E2.7(GND) E3.7(P:GND) E4.7(P:GND) E5.8(GND) E6.8(GND) E7.7(P:GND) E8.7(P:GND) E9.7(P:GND) E10.8(GND) E11.7(P:GND) E12.7(P:GND) E13.7(P:GND) E14.8(P:GND) E15.7(P:GND) E16.7(P:GND) E17.14(PWR:GND) E18.7(P:GND) E19.8(GND) E20.8(GND) E21.7(P:GND) E22.14(PWR:GND) E23.7(P:GND) E24.7(P:GND) E25.8(GND) E26.7(P:GND) E27.7(P:GND) E28.7(P:GND) E29.8(GND) E30.7(P:GND) E31.7(P:GND) E32.8(P:GND) E33.8(GND) E34.7(P:GND) E35.7(P:GND) E36.8(GND) E37.8(GND) E38.7(P:GND) E39.7(P:GND) E40.8(GND) E41.7(P:GND) E42.7(P:GND) E43.7(P:GND) E44.8(P:GND) E45.7(P:GND) E46.14(PWR:GND) E47.14(PWR:GND) E48.14(PWR:GND)
VCC: E1.14(VCC) E2.14(VCC) E3.14(P:VCC) E4.14(P:VCC) E5.16(VCC) E6.16(VCC) E7.14(P:VCC) E8.14(P:VCC) E9.14(P:VCC) E10.16(VCC) E11.14(P:VCC) E12.14(P:VCC) E13.14(P:VCC) E14.16(P:VCC) E15.14(P:VCC) E16.14(P:VCC) E17.1(PWR:VCC) E18.14(P:VCC) E19.16(VCC) E20.16(VCC) E21.14(P:VCC) E22.1(PWR:VCC) E23.14(P:VCC) E24.14(P:VCC) E25.16(VCC) E26.14(P:VCC) E27.14(P:VCC) E28.14(P:VCC) E29.16(VCC) E30.14(P:VCC) E31.14(P:VCC) E32.16(P:VCC) E33.16(VCC) E34.14(P:VCC) E35.14(P:VCC) E36.16(VCC) E37.16(VCC) E38.14(P:VCC) E39.14(P:VCC) E40.16(VCC) E41.14(P:VCC) E42.14(P:VCC) E43.14(P:VCC) E44.16(P:VCC) E45.14(P:VCC) E46.1(PWR:VCC) E47.1(PWR:VCC) E48.1(PWR:VCC)

## Library data of the parts
C1-C34 = rcl:C-US: CAPACITOR, American symbol
C100-C102 = dec-con:CPOL-USE20-8AXIAL: A 0.8 inch electrolytic.
E1 E2 = 74xx-us:74*30: 8-input NAND gate
E3 E15 = 74xx-us:74*04: Hex INVERTER
E4 = 74xx-us:74*13: Dual 4-input NAND schmitt trigger
E5 E19 E36 = dec-con:DS8641: Quad Bus Tranceiver
E6 E10 E20 E25 E37 E40 = 74xx-us:74*175: Qadruple D type FLIP FLOP, clear
E7 E11 E21 E23 E26 E27 E38 E41-E43 = 74xx-us:74*37: Quad 2-input NAND buffer
E8 E16 = 74xx-us:74*00: Quad 2-input NAND gate
E9 E24 E28 E39 E45 = dec-con:N8881: Quad 2-input NAND gate, open collector
E12 E30 E35 = 74xx-us:74*74: Dual D type positive edge triggered FLIP FLOP, preset and clear
E13 E34 = 74xx-us:74*08: Quad 2-input AND gate
E14 E32 = dec-con:DS8837: Hex inverting LINE RECEIVER
E17 E22 E46-E48 = dec-con:DEC2501: Diode Pack (Clamps)
E18 = 74xx-us:74*14: Hex schmitt trigger INVERTER
E29 E33 = 74xx-us:74*42: 4-line to 10-line DECODER (1-of-10)
E31 = 74xx-us:74*86: Quad 2-input EXCLUSIV-OR (XOR) gate
E44 = 74xx-us:74*123: Retriggerable monostable MULTIVIBRATOR
J1 J2 = dec-con:DEC40PIN: PIN HEADER
R1-R22 = rcl:R-US_: RESISTOR, American symbol
R23 R24 = dec-con:275P: Trimpot with 275P (3006Y) footprint.
U$2 = dec-con:QUAD: Quad-Height DEC board
U$4 = dec-con:OUTLINE-*: Board outlines for DEC boards.
W1-W32 = jumper:J: Bridge

## Net classes
1 Supply: width 0.813 mm